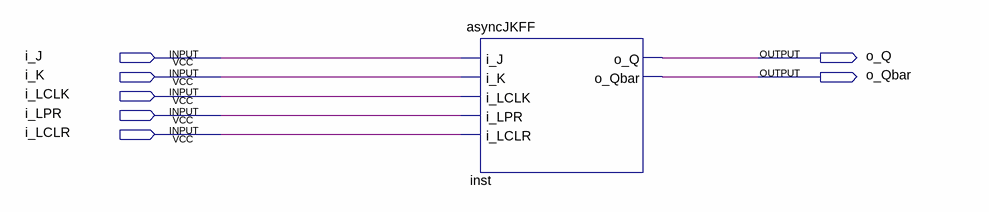
[diagram p0: schematic sheet]
// Quartus schematic async_JKFF.bdf as structural Verilog: 1 symbols, 7 pins
module async_JKFF (
  input  i_J,
  input  i_K,
  input  i_LCLK,
  input  i_LPR,
  input  i_LCLR,
  output o_Q,
  output o_Qbar
);

  asyncJKFF inst (.i_J(i_J), .i_K(i_K), .i_LCLK(i_LCLK), .i_LPR(i_LPR), .i_LCLR(i_LCLR), .o_Q(o_Q), .o_Qbar(o_Qbar));
endmodule
